# Altium schematic sheet JTAGICE Convertor.SchDoc: JTAGICE Convertor
size Letter; CheckedBy: Mohammad Sadr; Author: Mohammad Sadr; CompanyName: Mr. Farsi; DrawnBy: Mohammad Sadr; DocumentNumber: 1; Revision: v 1.0; SheetNumber: 1; SheetTotal: 2; Time: 23:38; DocumentName: JTAGICE Convertor; ProjectName: JTAGICE Convertor
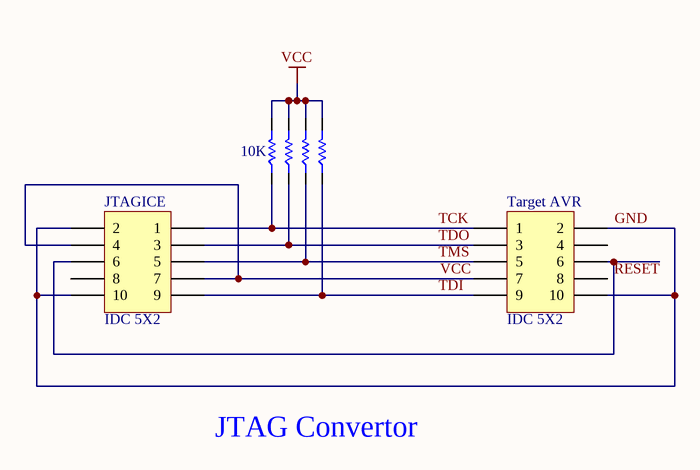
[diagram p0: JTAGICE Convertor.SchDoc]

## Parts
JTAGICE  IDC 5X2  [9181109421]
R1  10K  [Res-(1/4)]
R2  10K  [Res-(1/4)]  (value not drawn)
R3  10K  [Res-(1/4)]  (value not drawn)
R4  10K  [Res-(1/4)]  (value not drawn)
Target_AVR  IDC 5X2  [9181109421]

## Nets
VCC: JTAGICE.4 JTAGICE.7 R1.2 R2.2 R3.2 R4.2 Target_AVR.7
GND: JTAGICE.2 JTAGICE.10 Target_AVR.2 Target_AVR.10
RESET: JTAGICE.6 Target_AVR.6
TCK: JTAGICE.1 R1.1 Target_AVR.1
TDI: JTAGICE.9 R4.1 Target_AVR.9
TDO: JTAGICE.3 R2.1 Target_AVR.3
TMS: JTAGICE.5 R3.1 Target_AVR.5

Not connected (* = marked no-connect by the designer): JTAGICE 8; Target_AVR 4 8

## Notes on the sheet
- JTAG Convertor
- Title
- Size:
- Date:
- Letter
- Number:
- Time:
- Revision:
- Sheet
- of
- File:

## Library data of the parts
JTAGICE Target_AVR = IDC 5X2: Header, 5-Pin, Dual row; LatestRevisionDate: 17-Jul-2002; LatestRevisionNote: Re-released for DXP Platform.; Publisher: Altium Limited
R1-R4 = Resistor: Tolerance: 5%; Power: 1/8 W; Value: 10K